# EAGLE schematic CC1101-1190EM_Adapter_V3.00 (EAGLE 6.5.0)
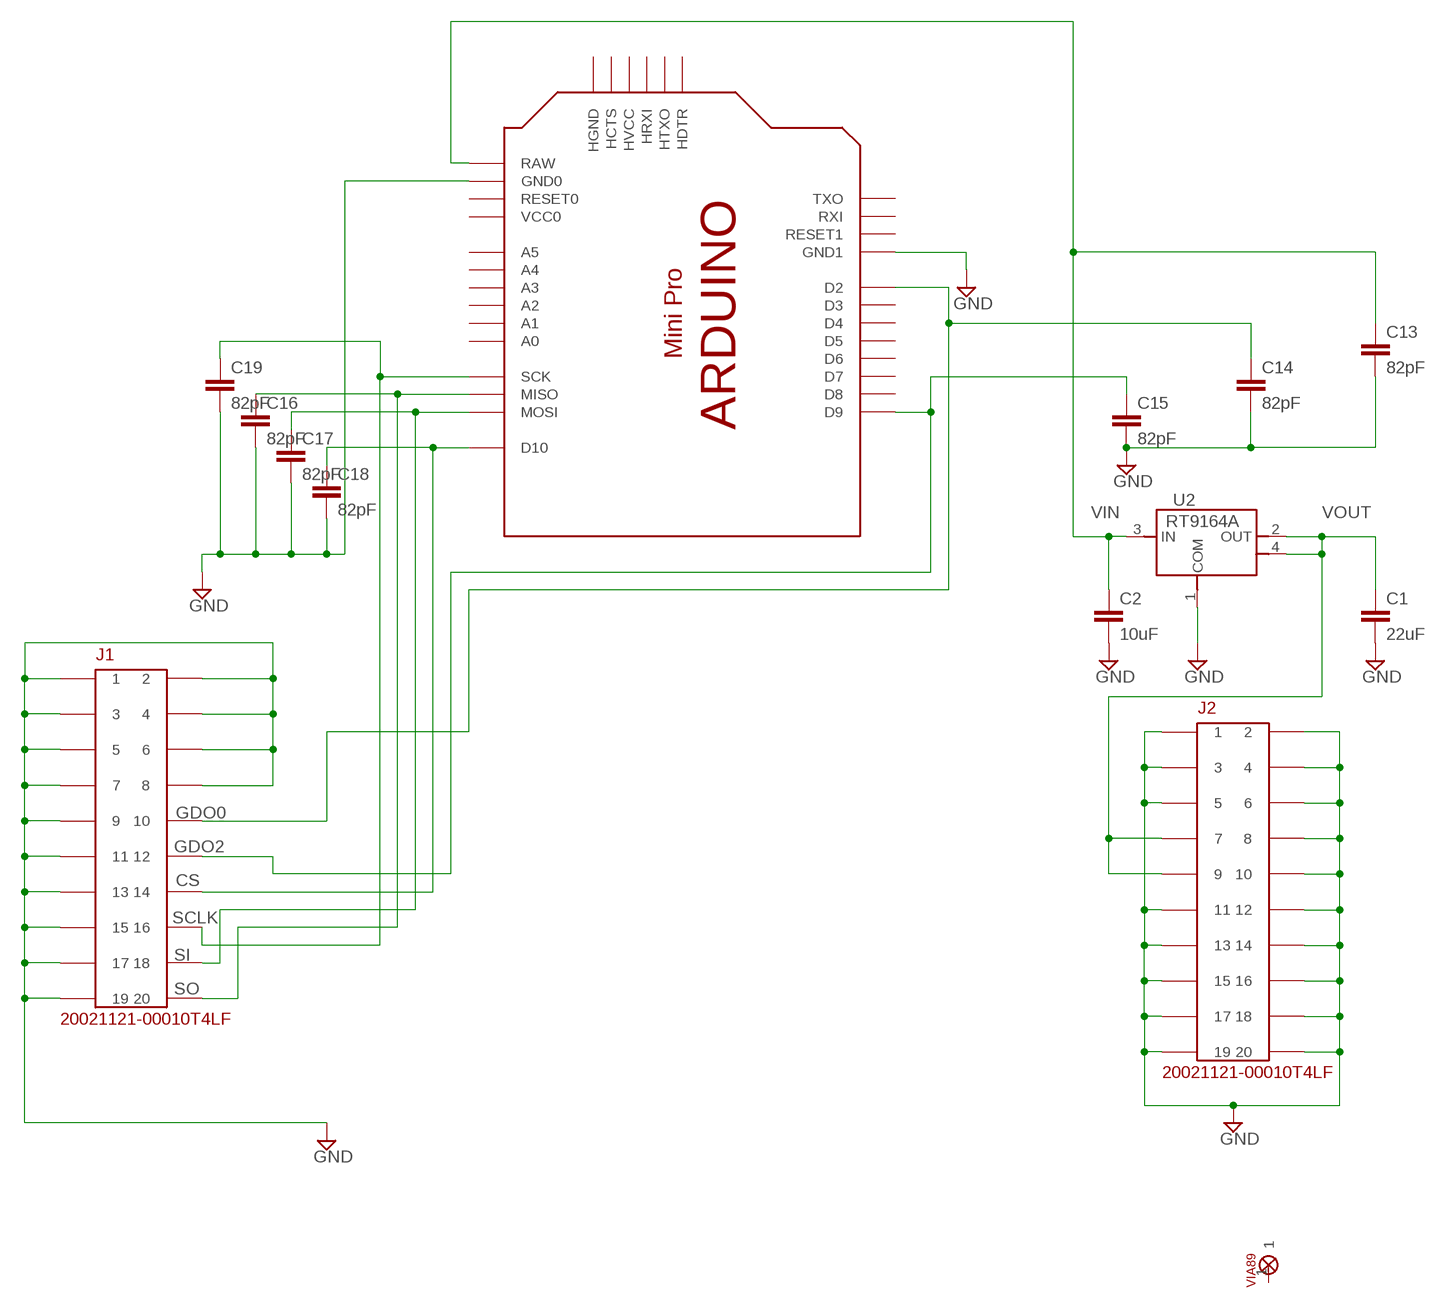
[diagram p0: schematic, sheet 1]

## Parts
C1  22uF  CC1206  [C1206]
C2  10uF  CC1206  [C1206]
C13  82pF  C  [C0805]
C14  82pF  C  [C0805]
C15  82pF  C  [C0805]
C16  82pF  C  [C0805]
C17  82pF  C  [C0805]
C18  82pF  C  [C0805]
C19  82pF  C  [C0805]
J1  20021121-00010T4LF  [PINHDR10X2_50X50MIL_SMT]
J2  20021121-00010T4LF  [PINHDR10X2_50X50MIL_SMT]
U2  RT9164A  [TO223]
U$1  ARDUINOMINI  [ARDUINOMINI]
VIA89  GND_VIA_NO_THERMAL  [VIA_NO_THERMAL]

## Nets
CS: C18.1 J1.P$14 U$1.P$30(D10)
GDO0: C14.1 J1.P$10 U$1.P$8(D2)
GDO2: C15.1 J1.P$12 U$1.P$1(D9)
GND: C1.2 C2.2 C13.2 C14.2 C15.2 C16.2 C17.2 C18.2 C19.2 J1.P$1 J1.P$2 J1.P$3 J1.P$4 J1.P$5 J1.P$6 J1.P$7 J1.P$8 J1.P$9 J1.P$11 J1.P$13 J1.P$15 J1.P$17 J1.P$19 J2.P$1 J2.P$2 J2.P$3 J2.P$4 J2.P$5 J2.P$6 J2.P$8 J2.P$10 J2.P$11 J2.P$12 J2.P$13 J2.P$14 J2.P$15 J2.P$16 J2.P$17 J2.P$18 J2.P$19 J2.P$20 U2.1(COM) U$1.P$9(GND1) U$1.P$20(GND0)
SCLK: C19.1 J1.P$16 U$1.P$27(SCK)
SI: C17.1 J1.P$18 U$1.P$29(MOSI)
SO: C16.1 J1.P$20 U$1.P$28(MISO)
VIN: C2.1 C13.1 U2.3(IN) U$1.P$19(RAW)
VOUT: C1.1 J2.P$7 J2.P$9 U2.2(OUT) U2.4(OUT)
Unconnected: U$1.P$2(D8) U$1.P$3(D7) U$1.P$4(D6) U$1.P$5(D5) U$1.P$6(D4) U$1.P$7(D3) U$1.P$10(RESET1) U$1.P$11(RXI) U$1.P$12(TXO) U$1.P$13(HDTR) U$1.P$14(HTXO) U$1.P$15(HRXI) U$1.P$16(HVCC) U$1.P$17(HCTS) U$1.P$18(HGND) U$1.P$21(RESET0) U$1.P$22(VCC0) U$1.P$23(A3) U$1.P$24(A2) U$1.P$25(A1) U$1.P$26(A0) U$1.P$34(A4) U$1.P$35(A5) VIA89.1

## Library data of the parts
C1 C2 C13-C19 = eagle-ltspice:C: CAPACITOR, European symbol; SPICEMODEL: NONE; SPICEPREFIX: C
J1 J2 = fhpower:20021121-00010T4LF: 2x10 50mil Male Pin Header Unshrouded
U2 = fhpower:RT9164A
U$1 = fhdevices:ARDUINOMINI
VIA89 = fhmechanical:GND_VIA_NO_THERMAL